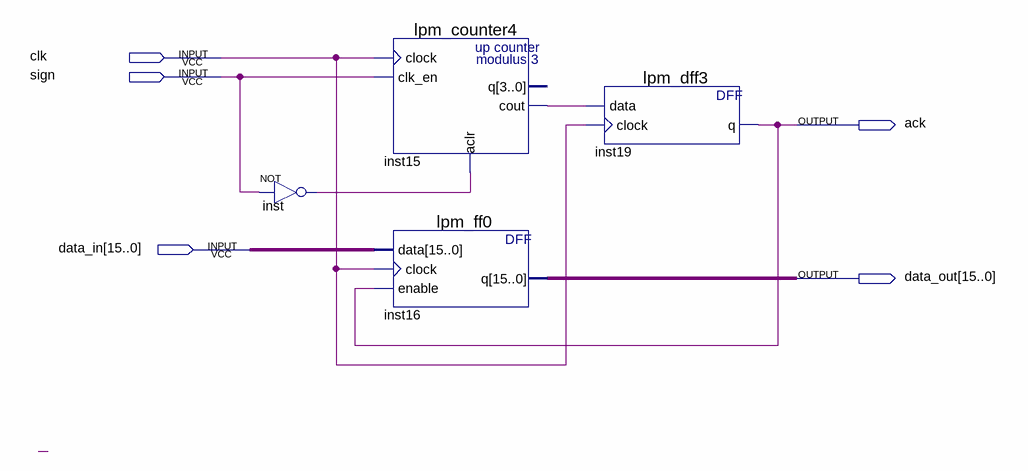
[diagram p0: schematic sheet]
// Quartus schematic slave_block_1.bdf as structural Verilog: 4 symbols, 5 pins
module slave_block_1 (
  input  clk,
  input  sign,
  input  [15:0] data_in,
  output ack,
  output [15:0] data_out
);

  wire inst15_cout, inst_out;

  not inst (inst_out, sign);
  lpm_counter4 inst15 (.clock(clk), .clk_en(sign), .aclr(inst_out), .cout(inst15_cout));  // open: q
  lpm_ff0 inst16 (.data(data_in), .clock(clk), .enable(ack), .q(data_out));
  lpm_dff3 inst19 (.data(inst15_cout), .clock(clk), .q(ack));
endmodule
